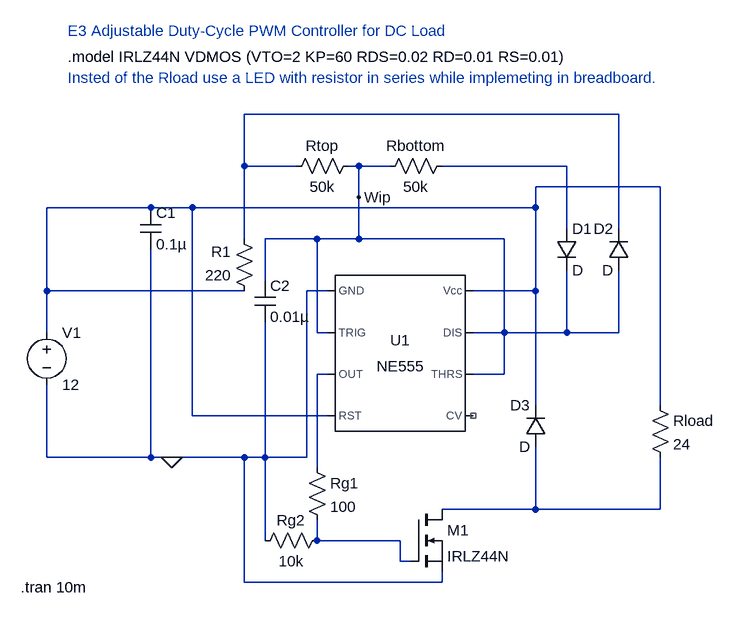
[diagram p0: schematic Adjustable Duty-Cycle PWM Controller .asc]
Adjustable Duty-Cycle PWM Controller .asc, the LTspice schematic file:
Version 4
SHEET 1 1368 680
WIRE 848 -336 272 -336
WIRE 272 -256 272 -336
WIRE 352 -256 272 -256
WIRE 448 -256 432 -256
WIRE 496 -256 448 -256
WIRE 768 -256 576 -256
WIRE 912 -224 720 -224
WIRE 448 -208 448 -256
WIRE 128 -192 -32 -192
WIRE 192 -192 128 -192
WIRE 720 -192 720 -224
WIRE 720 -192 192 -192
WIRE 768 -160 768 -256
WIRE 848 -160 848 -336
WIRE 272 -144 272 -256
WIRE 384 -144 304 -144
WIRE 448 -144 448 -208
WIRE 448 -144 384 -144
WIRE 672 -144 448 -144
WIRE 304 -80 304 -144
WIRE -32 -64 -32 -192
WIRE 272 -64 -32 -64
WIRE 400 -64 368 -64
WIRE 720 -64 720 -192
WIRE 720 -64 624 -64
WIRE -32 0 -32 -64
WIRE 384 0 384 -144
WIRE 400 0 384 0
WIRE 672 0 672 -144
WIRE 672 0 624 0
WIRE 768 0 768 -96
WIRE 768 0 672 0
WIRE 848 0 848 -96
WIRE 848 0 768 0
WIRE 400 64 384 64
WIRE 672 64 672 0
WIRE 672 64 624 64
WIRE 720 112 720 -64
WIRE 912 112 912 -224
WIRE 192 128 192 -192
WIRE 400 128 192 128
WIRE -32 192 -32 80
WIRE 128 192 128 -128
WIRE 128 192 -32 192
WIRE 160 192 128 192
WIRE 272 192 160 192
WIRE 304 192 304 -16
WIRE 304 192 272 192
WIRE 368 192 368 -64
WIRE 368 192 304 192
WIRE 384 208 384 64
WIRE 720 272 720 176
WIRE 720 272 576 272
WIRE 912 272 912 192
WIRE 912 272 720 272
WIRE 304 320 304 192
WIRE 384 320 384 288
WIRE 512 320 384 320
WIRE 512 352 512 320
WIRE 528 352 512 352
WIRE 272 384 272 192
WIRE 576 384 576 368
WIRE 576 384 272 384
FLAG 160 192 0
FLAG 448 -208 Wip
SYMBOL Misc\\NE555 512 32 R0
SYMATTR InstName U1
SYMBOL voltage -32 -16 R0
SYMATTR InstName V1
SYMATTR Value 12
SYMBOL res 368 192 R0
SYMATTR InstName Rg1
SYMATTR Value 100
SYMBOL cap 112 -192 R0
SYMATTR InstName C1
SYMATTR Value 0.1µ
SYMBOL res 448 -272 R90
WINDOW 0 0 56 VBottom 2
WINDOW 3 32 56 VTop 2
SYMATTR InstName Rtop
SYMATTR Value 50k
SYMBOL res 592 -272 R90
WINDOW 0 0 56 VBottom 2
WINDOW 3 32 56 VTop 2
SYMATTR InstName Rbottom
SYMATTR Value 50k
SYMBOL res 288 -48 R180
WINDOW 0 36 76 Left 2
WINDOW 3 36 40 Left 2
SYMATTR InstName R1
SYMATTR Value 220
SYMBOL cap 288 -80 R0
SYMATTR InstName C2
SYMATTR Value 0.01µ
SYMBOL res 400 304 R90
WINDOW 0 0 56 VBottom 2
WINDOW 3 32 56 VTop 2
SYMATTR InstName Rg2
SYMATTR Value 10k
SYMBOL diode 864 -96 R180
WINDOW 0 24 64 Left 2
WINDOW 3 24 0 Left 2
SYMATTR InstName D2
SYMBOL diode 752 -160 R0
SYMATTR InstName D1
SYMBOL res 896 96 R0
SYMATTR InstName Rload
SYMATTR Value 24
SYMBOL diode 736 176 R180
WINDOW 0 24 64 Left 2
WINDOW 3 24 0 Left 2
SYMATTR InstName D3
SYMBOL nmos 528 272 R0
SYMATTR InstName M1
SYMATTR Value IRLZ44N
TEXT -72 392 Left 2 !.tran 10m
TEXT 0 -424 Left 2 !.model IRLZ44N VDMOS (VTO=2 KP=60 RDS=0.02 RD=0.01 RS=0.01)
TEXT 0 -392 Left 2 ;Insted of the Rload use a LED with resistor in series while implemeting in breadboard.
TEXT 0 -464 Left 2 ;E3 Adjustable Duty-Cycle PWM Controller for DC Load

The netlist it stands for:
* Adjustable Duty-Cycle PWM Controller .asc
XU1 0 Wip N004 N003 NC_01 Wip Wip N003 NE555  ; pins GND TRIG OUT RST CV THRS DIS Vcc
V1 N003 0 12
Rg1 N004 N006 100
C1 N003 0 0.1µ
Rtop Wip N001 50k
Rbottom N002 Wip 50k
R1 N003 N001 220
C2 Wip 0 0.01µ
Rg2 N006 0 10k
D2 Wip N001 D
D1 N002 Wip D
Rload N003 N005 24
D3 N005 N003 D
M1 N005 N006 0 0 IRLZ44N
.model D D
.lib standard.dio
.model NMOS NMOS
.model PMOS PMOS
.lib standard.mos
.tran 10m
.model IRLZ44N VDMOS (VTO=2 KP=60 RDS=0.02 RD=0.01 RS=0.01)
* Insted of the Rload use a LED with resistor in series while implemeting in breadboard.
* E3 Adjustable Duty-Cycle PWM Controller for DC Load
.lib NE555.sub
.backanno
.end